# EAGLE design Decoder_Shield (EAGLE 5.06)
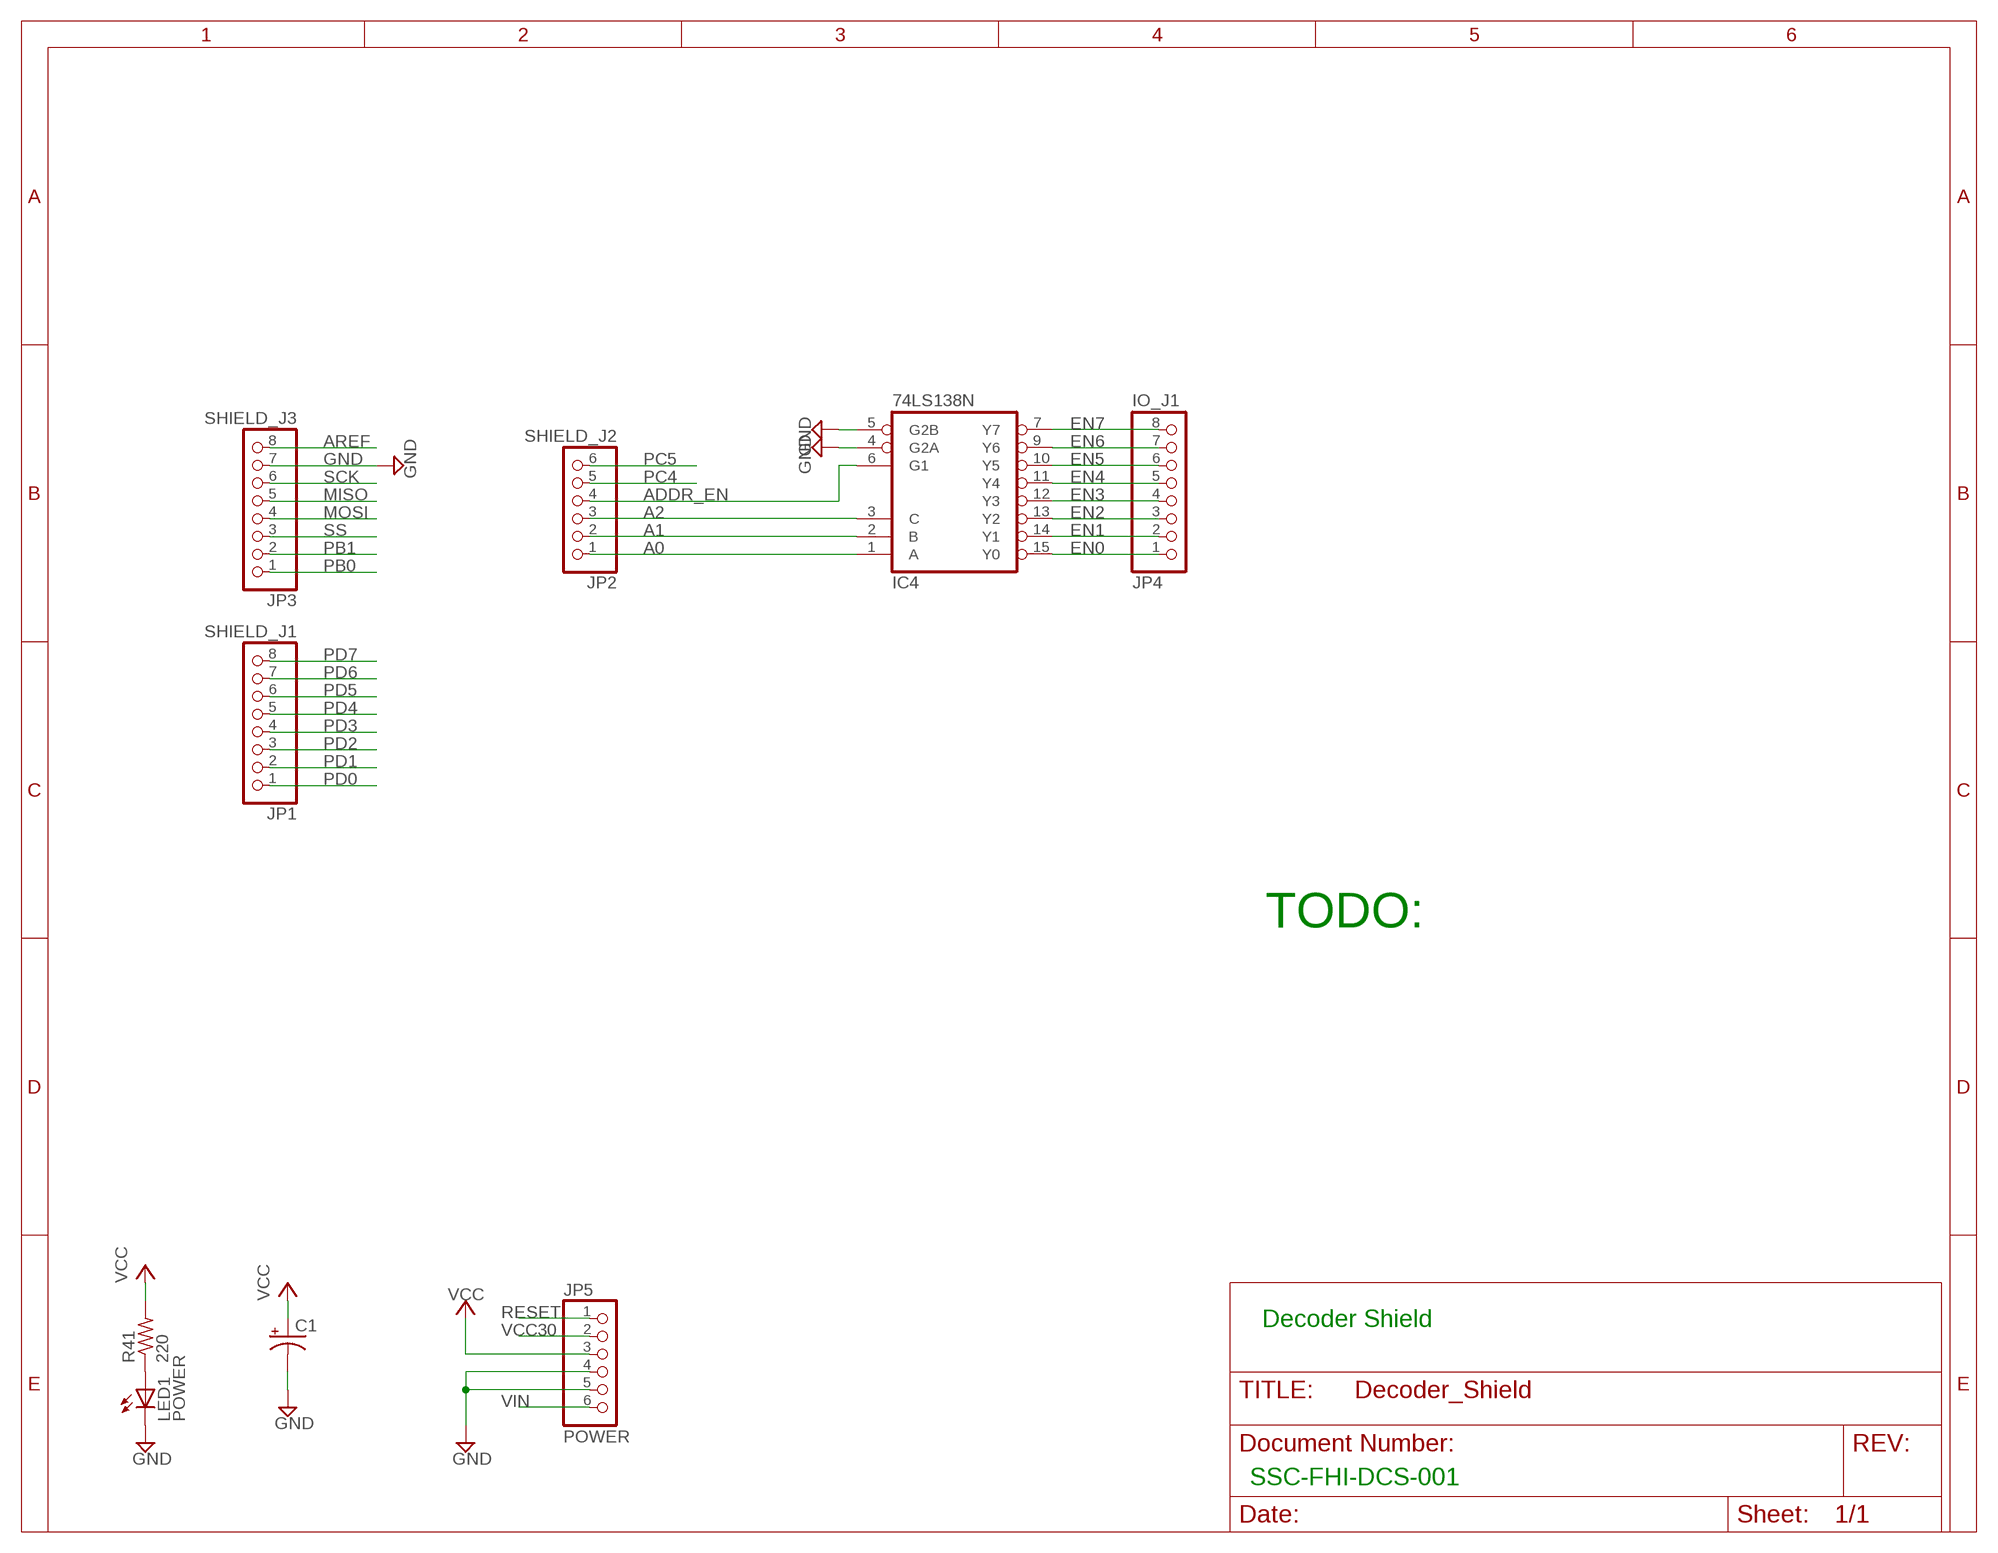
[diagram p0: schematic, sheet 1]

## Parts
C1  CPOL-USE2.5-5  [E2,5-5]
IC4  74LS138N  [DIL16]
JP1  SHIELD_J1  PINHD-1X8  [1X08]
JP2  SHIELD_J2  PINHD-1X6  [1X06]
JP3  SHIELD_J3  PINHD-1X8  [1X08]
JP4  IO_J1  PINHD-1X8  [1X08]
JP5  POWER  PINHD-1X6  [1X06]
LED1  POWER  LED5MM  [LED5MM]
R41  220  R-US_0204/7  [0204/7]

## Nets
A0: IC4.1(A) JP2.1
A1: IC4.2(B) JP2.2
A2: IC4.3(C) JP2.3
ADDR_EN: IC4.6(G1) JP2.4
AREF: JP3.8
EN0: IC4.15(Y0) JP4.1
EN1: IC4.14(Y1) JP4.2
EN2: IC4.13(Y2) JP4.3
EN3: IC4.12(Y3) JP4.4
EN4: IC4.11(Y4) JP4.5
EN5: IC4.10(Y5) JP4.6
EN6: IC4.9(Y6) JP4.7
EN7: IC4.7(Y7) JP4.8
GND: C1.- IC4.4(G2A) IC4.5(G2B) JP3.7 JP5.4 JP5.5 LED1.K(C)
MISO: JP3.5
MOSI: JP3.4
N$71: LED1.A R41.1
PB0: JP3.1
PB1: JP3.2
PC4: JP2.5
PC5: JP2.6
PD0: JP1.1
PD1: JP1.2
PD2: JP1.3
PD3: JP1.4
PD4: JP1.5
PD5: JP1.6
PD6: JP1.7
PD7: JP1.8
RESET: JP5.1
SCK: JP3.6
SS: JP3.3
VCC: C1.+ JP5.3 R41.2
VCC30: JP5.2
VIN: JP5.6

## Notes on the sheet
- TODO:
- Decoder Shield
- SSC-FHI-DCS-001

## Power pins joined to a net without a drawn wire
GND: IC4.8(GND)
VCC: IC4.16(VCC)

## Library data of the parts
C1 = rcl:CPOL-US: POLARIZED CAPACITOR, American symbol
IC4 = 74xx-eu:74*138: 3-line to 8-line DECODER/DEMULTIPLEXER
JP1 JP3 JP4 = pinhead:PINHD-1X8: PIN HEADER
JP2 JP5 = pinhead:PINHD-1X6: PIN HEADER
LED1 = led:LED: LED OSRAM: - CHIPLED LG R971, LG N971, LY N971, LG Q971, LY Q971, LO R971, LY R971 LH N974, LH R974 LS Q976, LO Q976, LY Q976 LO Q996 - Hyper CHIPLED LW Q18S LB Q993, LB Q99A, LB R99A - SideLED LS A670, LO A670, LY A670, LG A670, LP A670 LB A673, LV A673, LT A673, LW A673 LH A674 LY A675 LS A676, LA A676, LO A676, LY A676, LW A676 LS A679, LY A679, LG A679 - Hyper Micro SIDELED® LS Y876, LA Y876, LO Y876, LY Y876 LT Y87S - SmartLED LW L88C, LW L88S LB L89C, LB L89S, LG L890 LS L89K, LO L89K, LY L89K LS L896, LA L896, LO L896, LY L896 - TOPLED LS T670, LO T670, LY T670, LG T670, LP T670 LSG T670, LSP T670, LSY T670, LOP T670, LYG T670 LG T671, LOG T671, LSG T671 LB T673, LV T673, LT T673, LW T673 LH T674 LS T676, LA T676, LO T676, LY T676, LB T676, LH T676, LSB T676, LW T676 LB T67C, LV T67C, LT T67C, LS T67K, LO T67K, LY T67K, LW E67C LS E67B, LA E67B, LO E67B, LY E67B, LB E67C, LV E67C, LT E67C LW T67C LS T679, LY T679, LG T679 LS T770, LO T770, LY T770, LG T770, LP T770 LB T773, LV T773, LT T773, LW T773 LH T774 LS E675, LA E675, LY E675, LS T675 LS T776, LA T776, LO T776, LY T776, LB T776 LHGB T686 LT T68C, LB T68C - Hyper Mini TOPLED® LB M676 - Mini TOPLED Santana® LG M470 LS M47K, LO M47K, LY M47K Source: http://www.osram.convergy.de - LUMILED® LXK2-PW12-R00, LXK2-PW12-S00, LXK2-PW14-U00, LXK2-PW14-V00 LXK2-PM12-R00, LXK2-PM12-S00, LXK2-PM14-U00 LXK2-PE12-Q00, LXK2-PE12-R00, LXK2-PE12-S00, LXK2-PE14-T00, LXK2-PE14-U00 LXK2-PB12-K00, LXK2-PB12-L00, LXK2-PB12-M00, LXK2-PB14-N00, LXK2-PB14-P00, LXK2-PB14-Q00 LXK2-PR12-L00, LXK2-PR12-M00, LXK2-PR14-Q00, LXK2-PR14-R00 LXK2-PD12-Q00, LXK2-PD12-R00, LXK2-PD12-S00 LXK2-PH12-R00, LXK2-PH12-S00 LXK2-PL12-P00, LXK2-PL12-Q00, LXK2-PL12-R00 Source: www.luxeon.com
R41 = resistor:R-US_: RESISTOR, American symbol

## Board
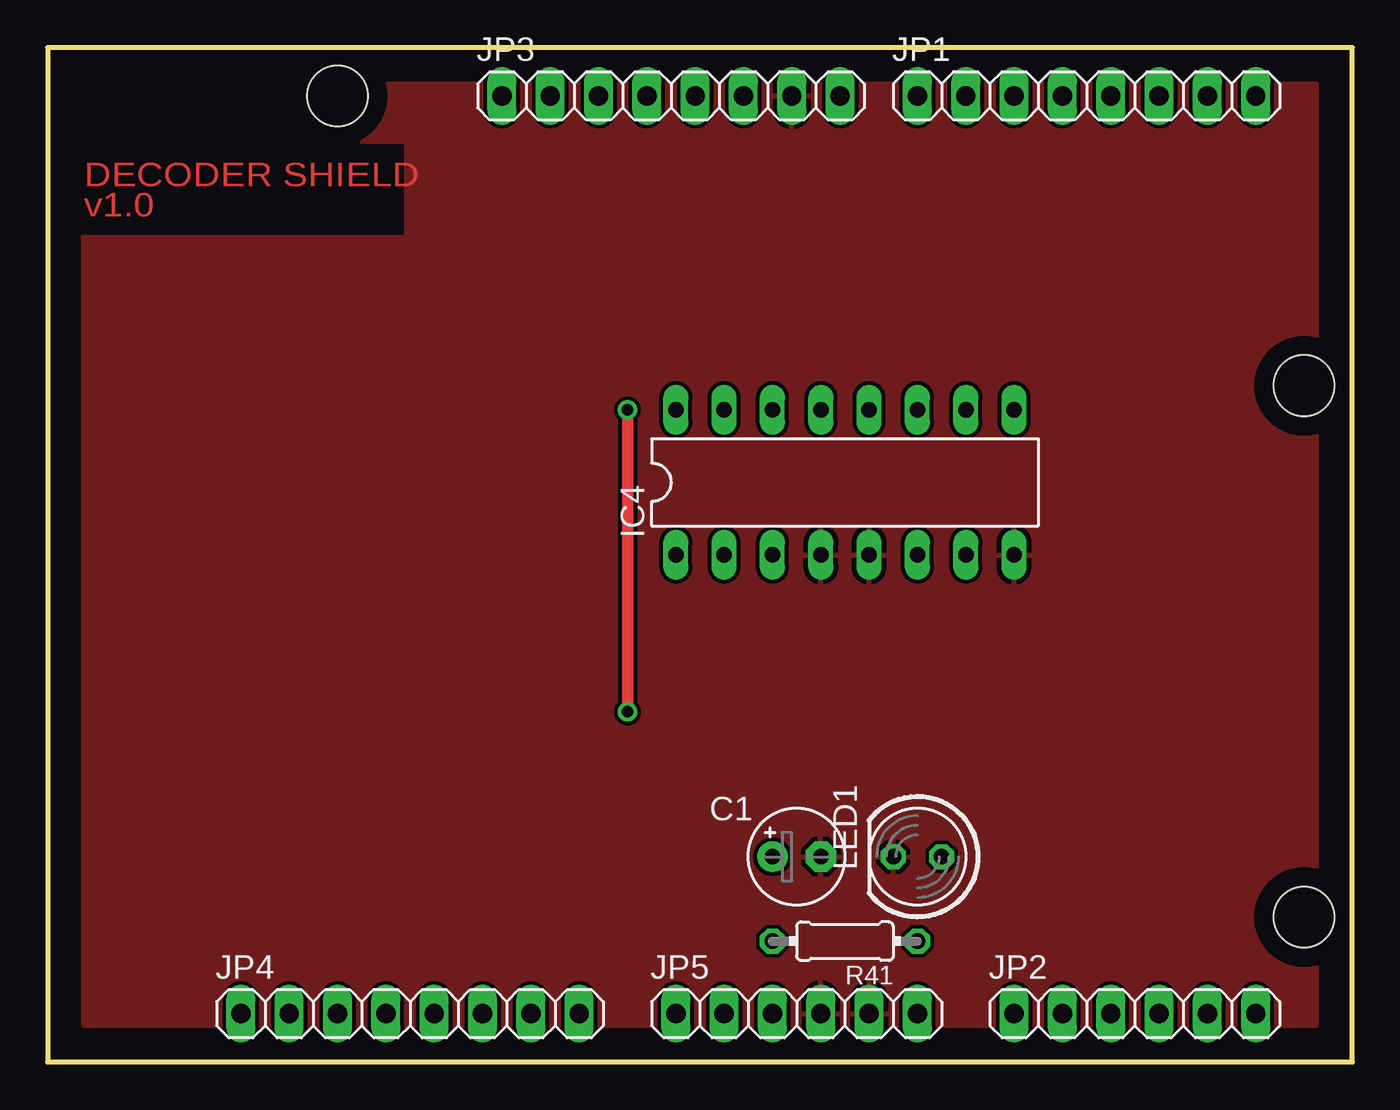
[diagram p1: board, top side]
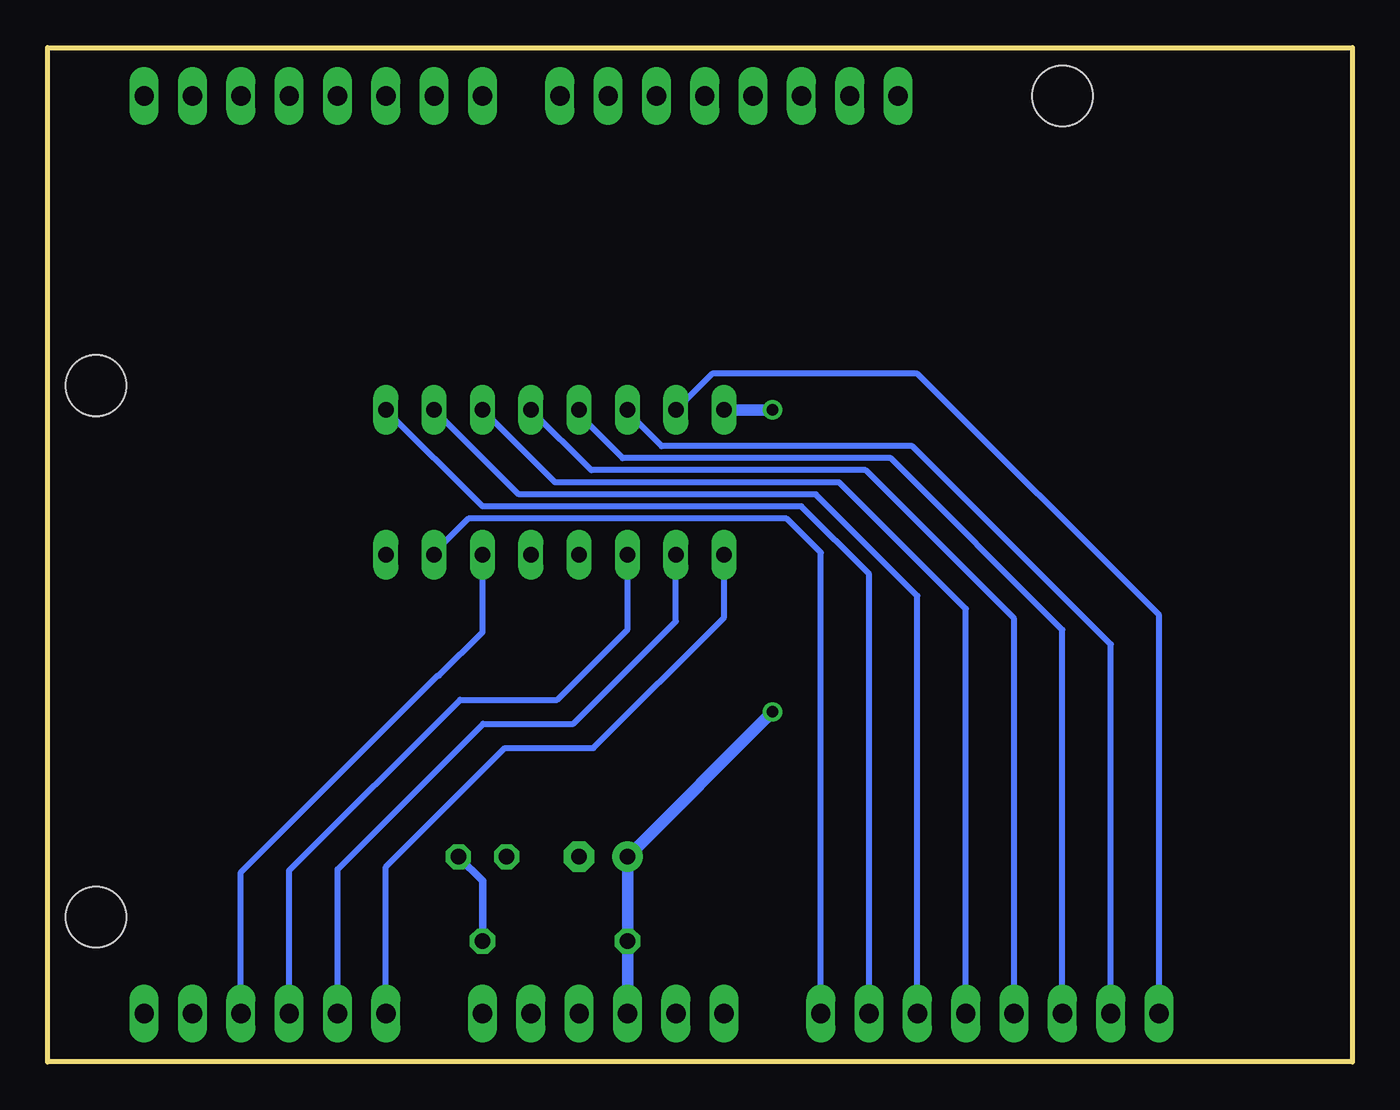
[diagram p2: board, bottom side, seen from below]

Size 68.58 x 53.34 mm. Coordinates in mm from the lower left corner, seen from the top.
Outline: 0,0 68.58,0 68.58,53.34 0,53.34 0,0
Copper layers (1*16): Top 0.035mm / dielectric 1.5mm / Bottom 0.035mm
Design rules "default *": minimum track width 8mil, minimum drill 20mil, track to track 8mil, track to pad 8mil, pad to pad 8mil, via to via 8mil, smd to smd 8mil, copper to edge 40mil, drill to drill 8mil, minimum pad ring 10mil, minimum via ring 8mil, stop-mask expansion 4mil, vias tented up to drill 0mil, thermal gap 10mil
Holes 3.2 mm at 15.24,50.8 66.04,35.56 66.04,7.62
tRestrict: area 0.6,43.5 to 18.7,48.3

### Footprints (pad centres in the part's own frame; a part is rotated, then mirrored left to right if it is on the bottom)
E2,5-5 = drill 0.813 pad 1.6 round: + -1.27,0 | drill 0.813 pad 1.6 octagon: - 1.27,0
DIL16 = drill 0.813 long: 1 -8.89,-3.81; 2 -6.35,-3.81; 3 -3.81,-3.81; 4 -1.27,-3.81; 5 1.27,-3.81; 6 3.81,-3.81; 7 6.35,-3.81; 8 8.89,-3.81; 9 8.89,3.81; 10 6.35,3.81; 11 3.81,3.81; 12 1.27,3.81; 13 -1.27,3.81; 14 -3.81,3.81; 15 -6.35,3.81; 16 -8.89,3.81
1X08 = drill 1.016 long: 1 -8.89,0; 2 -6.35,0; 3 -3.81,0; 4 -1.27,0; 5 1.27,0; 6 3.81,0; 7 6.35,0; 8 8.89,0
1X06 = drill 1.016 long: 1 -6.35,0; 2 -3.81,0; 3 -1.27,0; 4 1.27,0; 5 3.81,0; 6 6.35,0
LED5MM = drill 0.813 octagon: A -1.27,0; K 1.27,0
0204/7 = drill 0.813 octagon: 1 -3.81,0; 2 3.81,0

### Placement (x,y rotation side)
C1  39.37,10.79 0 top
IC4  41.91,30.48 0 top
JP1  54.61,50.8 0 top
JP2  57.15,2.54 0 top
JP3  32.77,50.8 0 top
JP4  19.05,2.54 0 top
JP5  39.37,2.54 0 top
LED1  45.72,10.79 180 top
R41  41.91,6.35 180 top

### Tracks (layer width: path | path; a pad name or v marks a point on that pad's centre or on a via)
A0
  Bottom 0.305: IC4.1 33.02,23.38 39.89,16.51 44.55,16.51 50.8,10.26 JP2.1
A1
  Bottom 0.305: IC4.2 35.56,23.17 40.95,17.78 45.69,17.78 53.34,10.13 JP2.2
A2
  Bottom 0.305: JP2.3 55.88,10.07 46.9,19.05 41.8,19.05 38.1,22.75 IC4.3
ADDR_EN
  Bottom 0.305: JP2.4 58.42,9.98 48.08,20.32 48.01,20.32 45.72,22.61 IC4.6
EN0
  Bottom 0.305: JP4.1 10.16,23.5 22.86,36.2 33.66,36.2 IC4.15
EN1
  Bottom 0.305: JP4.2 12.7,21.96 23.13,32.38 36.3,32.38 38.1,34.18 IC4.14
EN2
  Bottom 0.305: JP4.3 15.24,22.73 24.26,31.75 38.35,31.75 40.64,34.04 IC4.13
EN3
  Bottom 0.305: JP4.4 17.78,23.31 25.59,31.11 40.01,31.11 IC4.12
EN4
  Bottom 0.305: JP4.5 20.32,23.82 26.98,30.48 41.91,30.48 IC4.11
EN5
  Bottom 0.305: JP4.6 22.86,24.51 28.2,29.84 43.81,29.84 IC4.10
EN6
  Bottom 0.305: JP4.7 25.4,25.65 28.96,29.21 45.72,29.21 IC4.9
EN7
  Bottom 0.305: 27.94,3.81 JP4.8 27.94,26.78 29.74,28.57 46.46,28.57 48.26,26.78 IC4.7
GND
  pour Top: 1.91,51.44 66.67,51.44 66.67,47.62 66.67,15.24 66.67,1.91 1.91,1.91 1.91,6.99 1.91,35.56
N$71
  Bottom 0.406: R41.1 45.72,9.53 LED1.A
VCC  (via drill 0.6)
  Top 0.61: v30.48,18.41 v30.48,34.29
  Bottom 0.61: v30.48,34.29 IC4.16 | v30.48,18.41 C1.+ R41.2 JP5.3

### Text on the board
Top: DECODER SHIELD | v1.0